# EAGLE design XBee_Sensor (EAGLE 6.2)
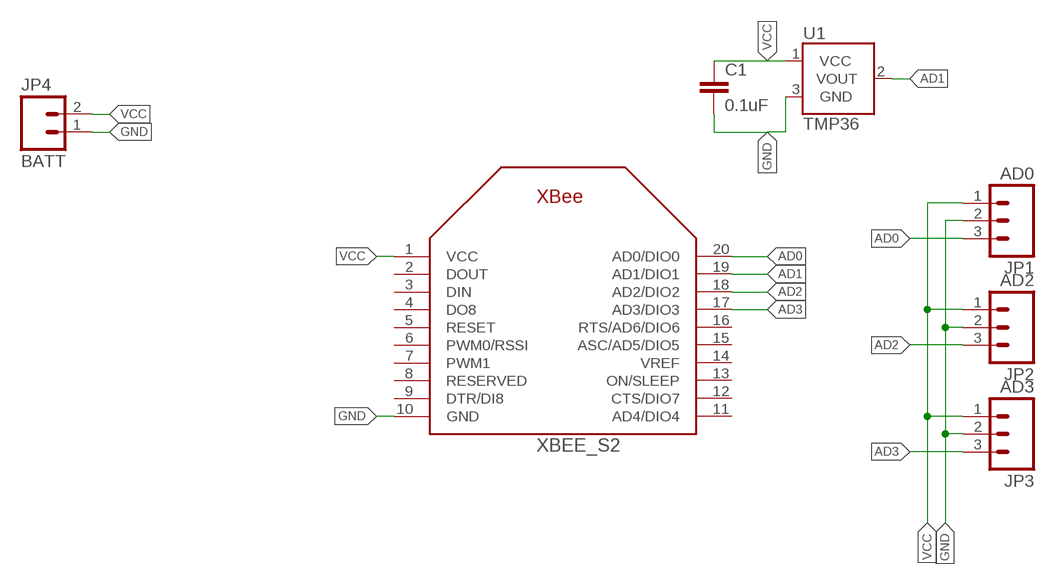
[diagram p0: schematic, sheet 1]

## Parts
C1  0.1uF  C-EU050-035X075  [C050-035X075]
JP1  AD0  M03JST-PTH  [JST-3-PTH]
JP2  AD2  M03JST-PTH  [JST-3-PTH]
JP3  AD3  M03JST-PTH  [JST-3-PTH]
JP4  BATT  M02JST-PTH-2  [JST-2-PTH]
U1  TMP36  [TO-92-AMMO]
XBEE_S2  XBEE  [XBEE]

## Nets
AD0: JP1.3 XBEE_S2.20(AD0/DIO0)
AD1: U1.2(VOUT) XBEE_S2.19(AD1/DIO1)
AD2: JP2.3 XBEE_S2.18(AD2/DIO2)
AD3: JP3.3 XBEE_S2.17(AD3/DIO3)
GND: C1.2 JP1.2 JP2.2 JP3.2 JP4.1 U1.3(GND) XBEE_S2.10(GND)
VCC: C1.1 JP1.1 JP2.1 JP3.1 JP4.2 U1.1(VCC) XBEE_S2.1(VCC)
Unconnected: XBEE_S2.2(DOUT) XBEE_S2.3(DIN) XBEE_S2.4(DO8) XBEE_S2.5(RESET) XBEE_S2.6(PWM0/RSSI) XBEE_S2.7(PWM1) XBEE_S2.8(RESERVED) XBEE_S2.9(DTR/DI8) XBEE_S2.11(AD4/DIO4) XBEE_S2.12(CTS/DIO7) XBEE_S2.13(ON/SLEEP) XBEE_S2.14(VREF) XBEE_S2.15(ASC/AD5/DIO5) XBEE_S2.16(RTS/AD6/DIO6)

## Library data of the parts
C1 = resistor:C-EU: CAPACITOR, European symbol
JP1-JP3 = SparkFun:M03: Header 3 Standard 3-pin 0.1" header. Use with straight break away headers (SKU : PRT-00116), right angle break away headers (PRT-00553), swiss pins (PRT-00743), machine pins (PRT-00117), and female headers (PRT-00115). Molex polarized connector foot print use with SKU : PRT-08232 with associated crimp pins and housings.
JP4 = SparkFun:M02: Header 2 Standard 2-pin 0.1" header. Use with straight break away headers (SKU : PRT-00116), right angle break away headers (PRT-00553), swiss pins (PRT-00743), machine pins (PRT-00117), and female headers (PRT-00115). Molex polarized connector foot print use with SKU : PRT-08233 with associated crimp pins and housings.
U1 = SparkFun:TMP36
XBEE_S2 = adafruit:XBEE

## Board
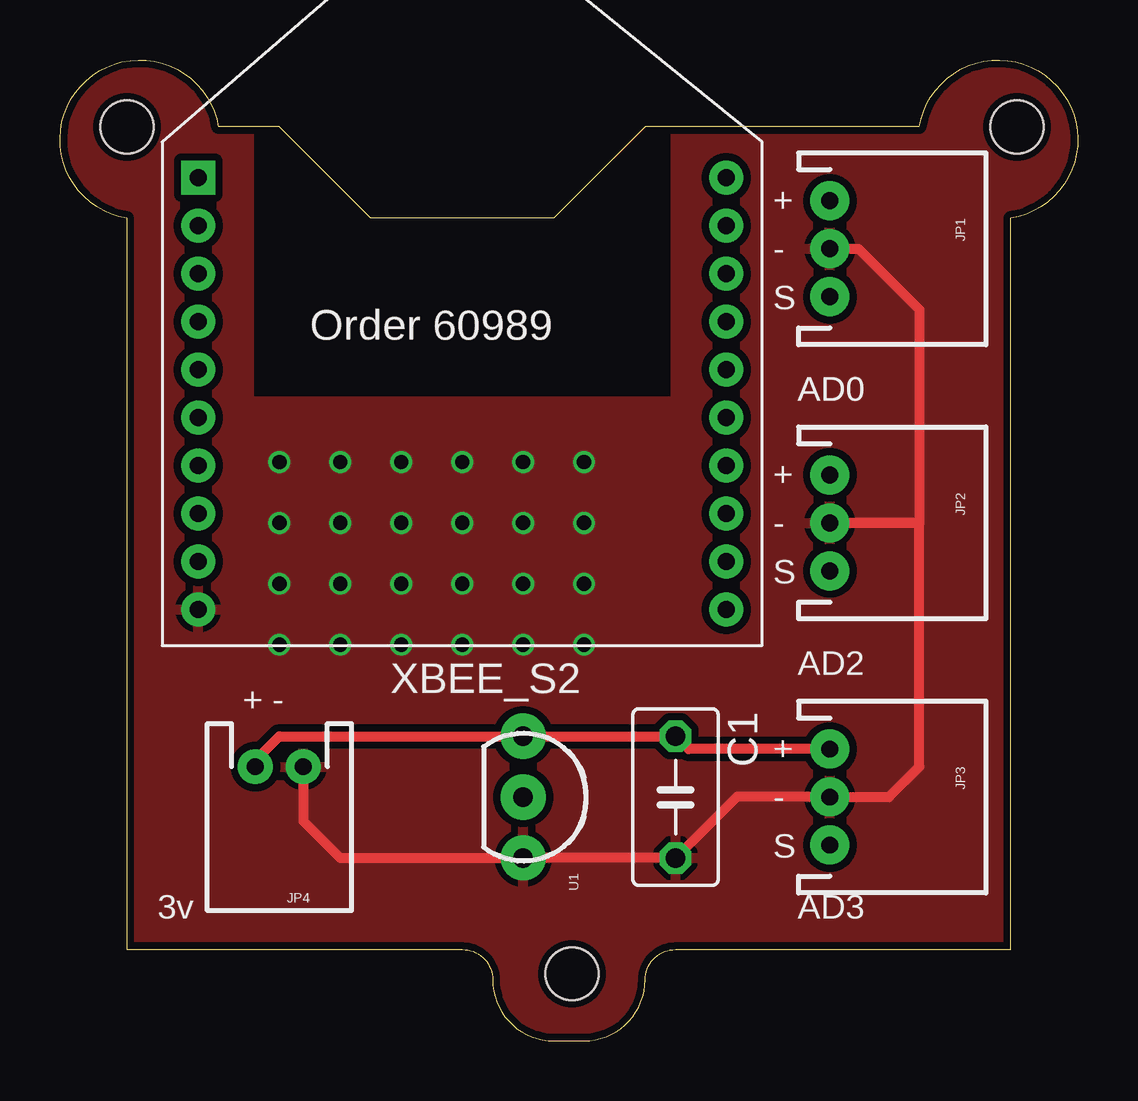
[diagram p1: board, top side]
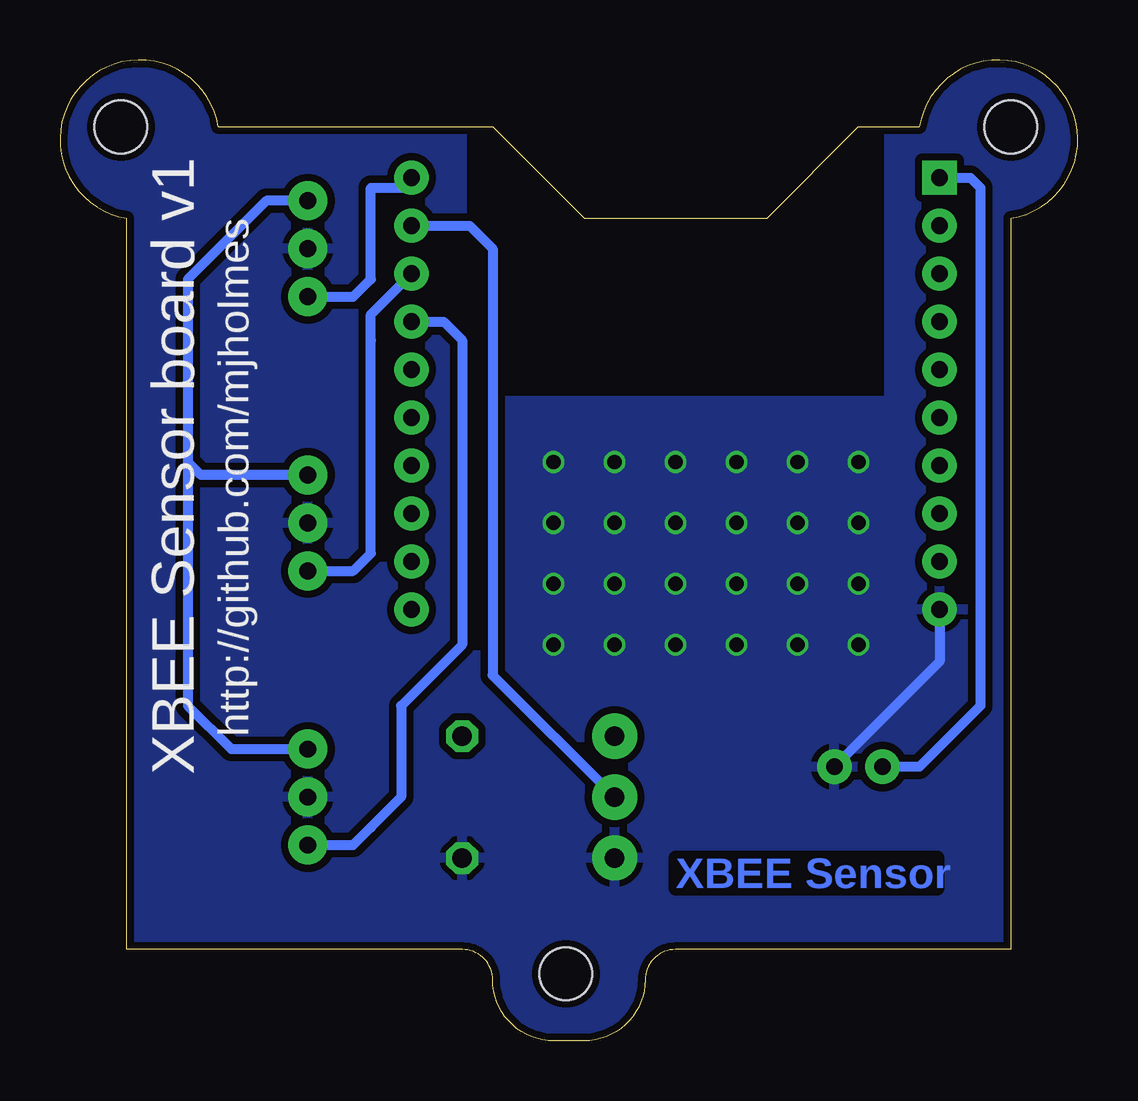
[diagram p2: board, bottom side, seen from below]

Size 42.41 x 40.89 mm. Coordinates in mm from the lower left corner, seen from the top.
Outline: 2.79,3.81 16.76,3.81 arc-90 18.03,2.54 arc90 20.57,0 21.84,0 arc90 24.38,2.54 arc-90 25.65,3.81 39.62,3.81 39.62,34.29 arc252 35.81,38.1 24.38,38.1 20.57,34.29 12.95,34.29 9.14,38.1 6.6,38.1 arc252 2.79,34.29 2.79,3.81
Copper layers (1*16): Top 0.035mm / dielectric 1.5mm / Bottom 0.035mm
Design rules: minimum track width 6mil, minimum drill 12mil, track to track 6mil, track to pad 6mil, pad to pad 6mil, via to via 6mil, smd to smd 0mil, copper to edge 10mil, drill to drill 10mil, minimum pad ring 10mil, minimum via ring 6mil, stop-mask expansion 2mil, vias tented up to drill 100mil, thermal gap 10mil
Holes 2.2 mm at 2.79,38.1 39.87,38.1 21.33,2.79

### Footprints (pad centres in the part's own frame; a part is rotated, then mirrored left to right if it is on the bottom)
C050-035X075 = drill 0.813 octagon: 1 -2.54,0; 2 2.54,0
JST-3-PTH = drill 0.7 pad 1.626: 1 -2,-5; 2 0,-5; 3 2,-5
JST-2-PTH = drill 0.7 pad 1.448: 1 -1,0; 2 1,0
TO-92-AMMO = drill 0.813 pad 1.88: 1 -2.54,0; 2 0,0; 3 2.54,0
XBEE = drill 0.7 pad 1.422 square: 1 -11,5.5 | drill 0.7 pad 1.422: 2 -11,3.5; 3 -11,1.5; 4 -11,-0.5; 5 -11,-2.5; 6 -11,-4.5; 7 -11,-6.5; 8 -11,-8.5; 9 -11,-10.5; 10 -11,-12.5; 11 11,-12.5; 12 11,-10.5; 13 11,-8.5; 14 11,-6.5; 15 11,-4.5; 16 11,-2.5; 17 11,-0.5; 18 11,1.5; 19 11,3.5; 20 11,5.5

### Placement (x,y rotation side)
C1  25.65,10.16 270 top
JP1  37.08,33.02 270 top
JP2  37.08,21.59 270 top
JP3  37.08,10.16 270 top
JP4  9.14,11.43 180 top
U1  19.3,10.16 270 top
XBEE_S2  16.76,30.48 0 top

### Tracks (layer width: path | path; a pad name or v marks a point on that pad's centre or on a via)
AD0
  Bottom 0.406: JP1.3 30.19,31.02 29.46,31.75 29.46,35.56 28.18,35.56 XBEE_S2.20
AD1
  Bottom 0.406: XBEE_S2.19 25.34,33.98 24.38,33.02 24.38,15.24 U1.2
AD2
  Bottom 0.406: JP2.3 30.19,19.59 29.46,20.32 29.46,29.21 29.46,30.28 XBEE_S2.18
AD3
  Bottom 0.406: JP3.3 30.19,8.16 29.46,8.89 28.19,10.16 28.19,13.97 25.65,16.51 25.65,29.21 26.42,29.98 XBEE_S2.17
GND  (via drill 0.6)
  Top 0.406: JP1.2 33.27,33.02 35.81,30.48 35.81,21.59 | 35.81,21.59 JP2.2 | 35.81,21.59 35.81,11.43 34.54,10.16 JP3.2 28.19,10.16 C1.2 U1.3 11.68,7.62 10.14,9.16 JP4.1
  Bottom 0.406: XBEE_S2.10 5.76,15.81 JP4.1
  other vias: 9.14,24.13 11.68,24.13 14.22,24.13 16.76,24.13 19.3,24.13 21.84,24.13 9.14,21.59 9.14,19.05 9.14,16.51 11.68,21.59 11.68,19.05 11.68,16.51 14.22,16.51 14.22,19.05 14.22,21.59 16.76,21.59 19.3,21.59 21.84,21.59 21.84,19.05 21.84,16.51 19.3,16.51 16.76,16.51 16.76,19.05 19.3,19.05
  pour Top (isolate 0.305): -1.02,40.64 7.87,40.64 7.87,26.67 25.65,26.67 25.65,40.64 42.16,40.64 42.16,0 -1.02,0
  pour Bottom (isolate 0.305): -1.02,40.64 7.87,40.64 7.87,26.67 25.65,26.67 25.65,40.64 42.16,40.64 42.16,-1.27 -1.02,-1.27
VCC
  Top 0.406: JP3.1 26.19,12.16 C1.1 U1.1 9.14,12.7 8.14,11.7 JP4.2
  Bottom 0.406: JP1.1 33.81,35.02 37.08,31.75 37.08,26.67 37.08,24.13 | 37.08,24.13 37.08,13.97 35.27,12.16 JP3.1 | JP2.1 36.54,23.59 37.08,24.13 | XBEE_S2.1 4.48,35.98 4.06,35.56 4.06,13.97 6.6,11.43 JP4.2

### Text on the board
Bottom: XBEE Sensor
tPlace: + | - | S | Order 60989 | AD0 | AD0 | + | - | S | AD2 | + - | + | - | S | 3v | AD3
bPlace: XBEE Sensor board v1 | http://github.com/mjholmes